# Altium schematic sheet PAGE3_POWER.SchDoc
size A; DrawnBy: Sean Donohue; Revision: A; SheetNumber: 3; SheetTotal: 4; Title2: POWER
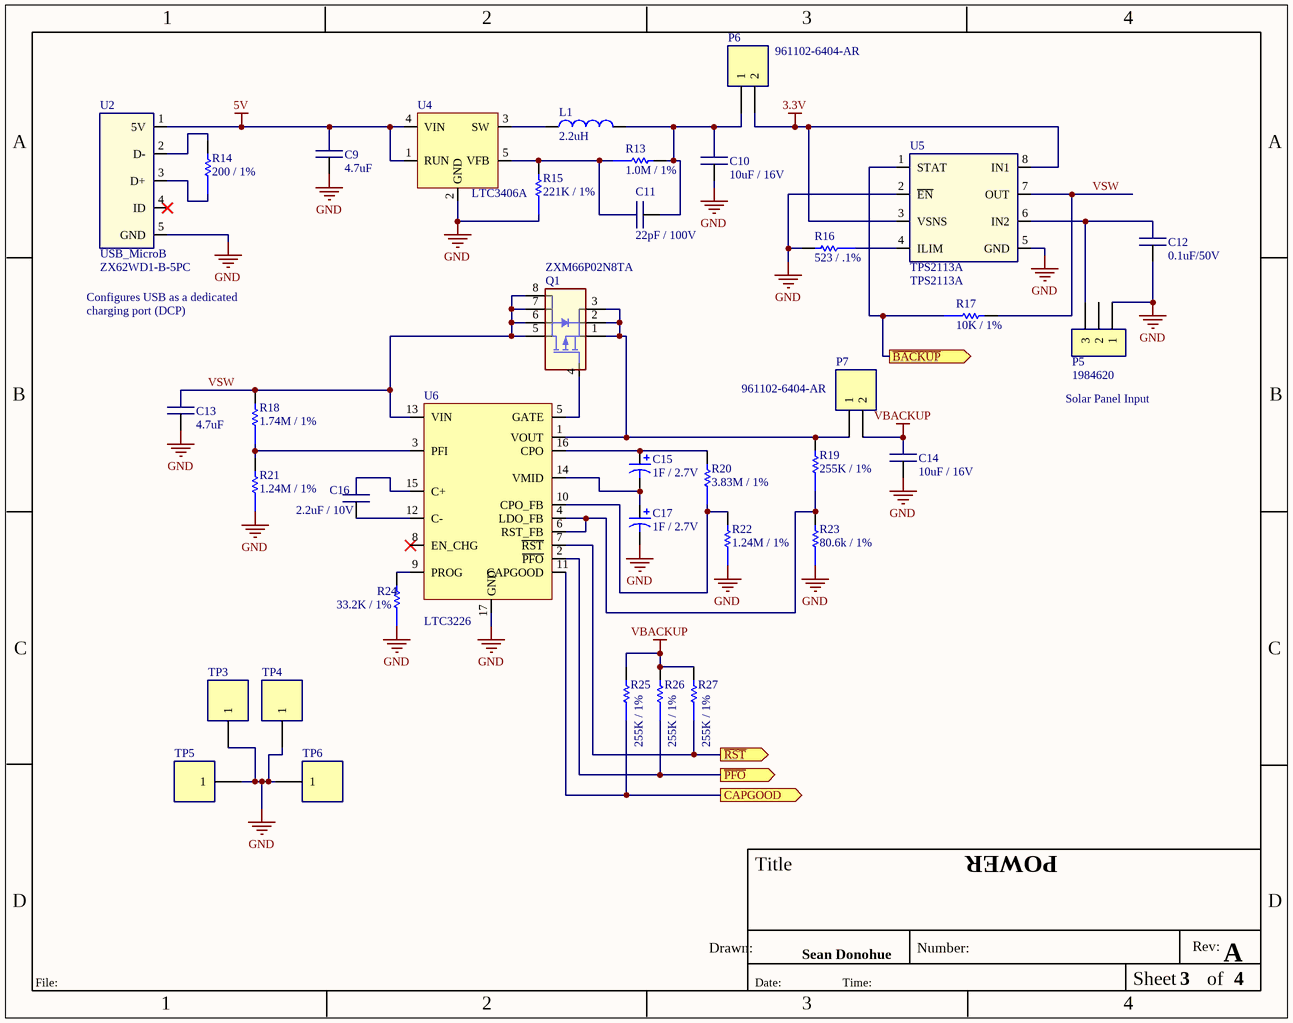
[diagram p0: PAGE3_POWER.SchDoc]

## Parts
C9  value 4.7uF  [0805]  (hidden comment: cap)
C10  value 10uF / 16V  [0603]  (hidden comment: cap)
C11  value 22pF / 100V  [0603]  (hidden comment: cap)
C12  value 0.1uF/50V  [0603]  (hidden comment: cap)
C13  value 4.7uF  [0805]  (hidden comment: cap)
C14  value 10uF / 16V  [0603]  (hidden comment: cap)
C15  value 1F / 2.7V  [Cap8x11_5]  (hidden comment: Cap Pol)
C16  value 2.2uF / 10V  [0603]  (hidden comment: cap)
C17  value 1F / 2.7V  [Cap8x11_5]  (hidden comment: Cap Pol)
L1  value 2.2uH  [LQH32C]  (hidden comment: Inductor)
P5  value 1984620  [CONN_PHOENIX_3P_1984620]  (hidden comment: Header 3)
P6  value 961102-6404-AR  [HDR1X2]  (hidden comment: Header 2)
P7  value 961102-6404-AR  [HDR1X2]  (hidden comment: Header 2)
Q1  value ZXM66P02N8TA  [SO-8]  (hidden comment: PMOS_POWER-8)
R13  value 1.0M / 1%  [0603]  (hidden comment: Res)
R14  value 200 / 1%  [0603]  (hidden comment: Res)
R15  value 221K / 1%  [0603]  (hidden comment: Res)
R16  value 523 / .1%  [0603]  (hidden comment: Res)
R17  value 10K / 1%  [0603]  (hidden comment: Res)
R18  value 1.74M / 1%  [0603]  (hidden comment: Res)
R19  value 255K / 1%  [0603]  (hidden comment: Res)
R20  value 3.83M / 1%  [0603]  (hidden comment: Res)
R21  value 1.24M / 1%  [0603]  (hidden comment: Res)
R22  value 1.24M / 1%  [0603]  (hidden comment: Res)
R23  value 80.6k / 1%  [0603]  (hidden comment: Res)
R24  value 33.2K / 1%  [0603]  (hidden comment: Res)
R25  value 255K / 1%  [0603]  (hidden comment: Res)
R26  value 255K / 1%  [0603]  (hidden comment: Res)
R27  value 255K / 1%  [0603]  (hidden comment: Res)
TP3  Header 1  [HDR1]  (value not drawn)
TP4  Header 1  [HDR1]  (value not drawn)
TP5  Header 1  [HDR1]  (value not drawn)
TP6  Header 1  [HDR1]  (value not drawn)
U2  USB_MicroB  value ZX62WD1-B-5PC  [ZX62WD1-B-5PC]
U4  LTC3406A  [TSOT-23-5]
U5  TPS2113A  [TSSOP-8]
U6  LTC3226  [WFQFN-16]

## Ports
CAPGOOD (out), ~{BACKUP} (out), ~{PFO} (out), ~{RST} (out)

## Nets
3.3V: P6.2 U5.3(VSNS) U5.8(IN1)
5V: C9.1 U2.1(5V) U4.1(RUN) U4.4(VIN)
GND: C9.2 C10.2 C12.2 C13.2 C14.2 C17.2 P5.1 R15.1 R16.2 R21.1 R22.1 R23.1 R24.1 TP3.1 TP4.1 TP5.1 TP6.1 U2.5(GND) U4.2(GND) U5.2(~{EN}) U5.5(GND) U6.17(GND)
VBACKUP: C14.1 P7.2 R25.2 R26.2 R27.2
~{BACKUP}: R17.1 U5.1(STAT) ; port ~{BACKUP}
~{PFO}: R26.1 U6.2(~{PFO}) ; port ~{PFO}
~{RST}: R27.1 U6.7(~{RST}) ; port ~{RST}
CAPGOOD: R25.1 U6.11(CAPGOOD) ; port CAPGOOD
VSW: C13.1 Q1.5(D) Q1.6(D) Q1.7(D) Q1.8(D) R17.2 R18.2 U5.7(OUT) U6.13(VIN)
NetC10_1: C10.1 C11.2 L1.2 P6.1 R13.2
NetC11_1: C11.1 R13.1 R15.2 U4.5(VFB)
NetC12_1: C12.1 P5.3 U5.6(IN2)
NetC15_1: C15.1 R20.2 U6.16(CPO)
NetC15_2: C15.2 C17.1 U6.14(VMID)
NetC16_1: C16.1 U6.15(C+)
NetC16_2: C16.2 U6.12(C-)
NetL1_1: L1.1 U4.3(SW)
NetP7_1: P7.1 Q1.1(S) Q1.2(S) Q1.3(S) R19.2 U6.1(VOUT)
NetQ1_4: Q1.4(G) U6.5(GATE)
NetR14_1: R14.1 U2.3(D+)
NetR14_2: R14.2 U2.2(D-)
NetR16_1: R16.1 U5.4(ILIM)
NetR18_1: R18.1 R21.2 U6.3(PFI)
NetR19_1: R19.1 R23.2 U6.4(LDO_FB) U6.6(RST_FB)
NetR20_1: R20.1 R22.2 U6.10(CPO_FB)
NetR24_2: R24.2 U6.9(PROG)

Not connected (* = marked no-connect by the designer): P5 2; U2 4(ID)*; U6 8(EN_CHG)*

## Notes on the sheet
- Configures USB as a dedicated charging port (DCP)
- Solar Panel Input
- 1
- 2
- 3
- 4
- A
- B
- C
- D
- Title
- Drawn:
- Number:
- Rev:
- File:
- Date:
- Time:
- Sheet
- of

## Library data of the parts
C9 C13 = ECC4702XR: CAP 4.7uF 16V X7R 0805; Mfg: Murata; MfgPN: GRM21BR71C475KA73L; Vendor: Digikey; VendorPN: 490-4522-1; Unit Cost: 0.88; Temp: '-55°C ~ 125°C; EetrexPN: ECC4702XR
C10 C14 = EXC142: CAP CER 10UF 16V X5R 0603; EetrexPN: EXC142; Mfg: Taiyo Uden; MfgPN: EMK107BBJ106MA-T; Vendor: Digkey; VendorPN: 587-3238-1-ND; Unit Cost: 0.63; Temp: -55°C ~ 85°C
C11 = EXC140: CAP CER 22PF 100V NP0 0603; EetrexPN: EXC140; Mfg: KEMET; MfgPN: C0603C220J1GACTU; Vendor: Digikey; VendorPN: 399-7874-1-ND; Unit Cost: 0.1; Temp: -55°C ~ 125°C
C12 = ECM1045XQ: CAP CER 0.1UF 50V 10% X7R 0603; Mfg: Murata; MfgPN: GRM188R71H104KA93D; Vendor: Digikey; VendorPN: 490-1519-1-ND; Alt Mfg: TDK; Alt PN: C1608X7R1H104K; Unit Cost: 0.1; Temp: -55°C ~ 125°C; COST/10: 0.041; COST/50: 0.0222; COST/100: 0.0187; COST/500: 0.0131; EetrexPN: ECM1045XQ
C15 C17 = EXC139: CAP 1F 2.7V THROUGH HOLE; EetrexPN: EXC139; Mfg: Maxwell; MfgPN: BCAP0001 P270 T01; Vendor: Digikey; VendorPN: 1182-1006-ND; Unit Cost: 2.3; Temp: -40°C ~ 85°C
C16 = EXC141: CAP CER 2.2UF 10V X7R 0603; EetrexPN: EXC141; Mfg: Samsung; MfgPN: CL10B225KP8NFNC; Vendor: Digikey; VendorPN: 1276-2016-1-ND; Unit Cost: 0.15; Temp: -55°C ~ 125°C
L1 = EL48: FIXED IND 2.2UH 790MA 97 MOHM; EetrexPN: EL48; Mfg: Murata; MfgPN: LQH32CN2R2M53L; Vendor: Digikey; VendorPN: 490-4056-1-ND; Unit Cost: 0.35; Temp: -40°C ~ 85°C
P5 = EKP73: CONN TERM BLOCK T/H 3POS 3.5MM; EetrexPN: EKP73; Mfg: Phoenix Contact; Vendor: Digikey; VendorPN: 277-1722-ND; Unit Cost: 0.55; UL: YES; MfgPN: 1984620; CSA: YES
P6 P7 = EKP117: CONN HEADER VERT SGL 2POS GOLD; EetrexPN: EKP117; Mfg: 3M; Vendor: Digikey; VendorPN: 3M9447-ND; Unit Cost: 0.16; MfgPN: 961102-6404-AR
Q1 = E333: MOSFET P-CH 20V 8A 8-SOIC; EetrexPN: E333; Mfg: Diodes inc; Vendor: Digikey; VendorPN: ZXM66P02N8CT-ND; Unit Cost: 2.61; Temp: -55°C ~ 150°C; MfgPN: ZXM66P02N8TA
R13 = ER265: RES 1M OHM 1% 1/10W 0603 SMD; Mfg: Panasonic; MfgPN: ERJ-3EKF1004V; Vendor: Digikey; VendorPN: P1.00MHCT-ND; EetrexPN: ER265; Unit Cost: 0.1; Temp: -55°C ~ 155°C
R14 = ER264: RES 200 OHM 1% 1/10W 0603 SMD; Mfg: Panasonic; MfgPN: ERJ-3EKF2000V; Vendor: Digikey; VendorPN: P200HCT-ND; EetrexPN: ER264; Unit Cost: 0.1; Temp: -55°C ~ 155°C
R15 = ER266: RES 221K OHM 1% 1/10W 0603 SMD; Mfg: Panasonic; MfgPN: ERJ-3EKF2213V; Vendor: Digikey; VendorPN: P221KHCT-ND; EetrexPN: ER266; Unit Cost: 0.1; Temp: -55°C ~ 155°C
R16 = ERE5230BP: RES 523 OHM 1/10W .1% 0603 SMD; Mfg: Susumu; MfgPN: RG1608P-5230-B-T5; Vendor: Digikey; VendorPN: RG16P523BCT-ND; Alt Mfg: Panasonic; Alt PN: ERA-3AEB5230V; Unit Cost: 0.204; Ref: ER149; EetrexPN: ERE5230BP
R17 = ER275: RES 10K OHM 1% 1/8W 0603 SMD; Mfg: Vishay; MfgPN: MCT06030C1002FP500; Vendor: Digikey; VendorPN: MCT0603-10.0K-CFCT-ND; EetrexPN: ER275; Unit Cost: 0.17; Temp: -55°C ~ 155°C
R18 = ER268: RES 1.74M OHM 1% 1/10W 0603 SMD; Mfg: Vishay; MfgPN: CRCW06031M74FKEA; Vendor: Digikey; VendorPN: 541-1.74MHCT-ND; EetrexPN: ER268; Unit Cost: 0.1; Temp: -55°C ~ 155°C
R19 R25-R27 = ER270: RES 255K OHM 1% 1/10W 0603 SMD; Mfg: Panasonic; MfgPN: ERJ-3EKF2553V; Vendor: Digikey; VendorPN: P255KHCT-ND; EetrexPN: ER270; Unit Cost: 0.1; Temp: -55°C ~ 155°C
R20 = ER272: RES 3.83M OHM 1% 1/10W 0603 SMD; Mfg: Vishay; MfgPN: CRCW06033M83FKEA; Vendor: Digikey; VendorPN: 541-3.83MHCT-ND; EetrexPN: ER272; Unit Cost: 0.1; Temp: -55°C ~ 155°C
R21 R22 = ER269: RES 1.24M OHM 1% 1/10W 0603 SMD; Mfg: Vishay; MfgPN: CRCW06031M24FKEA; Vendor: Digikey; VendorPN: 541-1.24MHCT-ND; EetrexPN: ER269; Unit Cost: 0.1; Temp: -55°C ~ 155°C
R23 = ER271: RES 80.6K OHM 1% 1/10W 0603 SMD; Mfg: Panasonic; MfgPN: ERJ-3EKF8062V; Vendor: Digikey; VendorPN: P80.6KHCT-ND; EetrexPN: ER271; Unit Cost: 0.1; Temp: -55°C ~ 155°C
R24 = ER267: RES 33.2K OHM 1% 1/10W 0603 SMD; Mfg: Panasonic; MfgPN: ERJ-3EKF3322V; Vendor: Digikey; VendorPN: P33.2KHCT-ND; EetrexPN: ER267; Unit Cost: 0.1; Temp: -55°C ~ 155°C
TP3-TP6 = ekp17: CONN HEADER 1POS .330 tall, TIN; Value: HDR1; EetrexPN: ekp17; Mfg: Samtec; MfgPN: TSW-101-07-T-S; Vendor: Digikey; VendorPN: SAM1035-01-ND; Unit Cost: 0.36
U2 = EKP114: CONN RCPT MICRO USB B SPLASH PRF; EetrexPN: EKP114; Mfg: Hirose; Vendor: Digikey; VendorPN: H12193CT-ND; Unit Cost: 2.00; Temp: -40°C ~ 85°C; MfgPN: ZX62WD1-B-5PC
U4 = E332: IC REG BUCK ADJ 0.6A SYNC TSOT23; EetrexPN: E332; Mfg: Linear Tech; MfgPN: LTC3406ABES5#TRMPBF; Vendor: Digikey; VendorPN: LTC3406ABES5#TRMPBFCT-ND; Unit Cost: 4.22; Temp: -40°C ~ 85°C; Value: LTC3406A
U5 = E331: IC OR CTRLR SRC SELECT 8TSSOP; EetrexPN: E331; Mfg: Texas Instruments; MfgPN: TPS2113APWR; Vendor: Digikey; VendorPN: 296-16938-1-ND; Unit Cost: 2.05; Temp: -40°C ~ 85°C; Value: TPS2113A
U6 = E330: IC 2CELL SUPERCAP CHARGE 16QFN; EetrexPN: E330; Mfg: Linear Tech; MfgPN: LTC3226EUD#PBF; Vendor: Digikey; VendorPN: LTC3226EUD#PBF-ND; Unit Cost: 5.7; Temp: -40°C ~ 125°C; Value: LTC3226